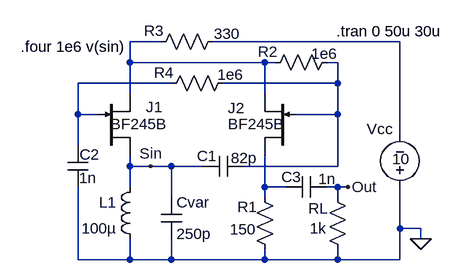
[diagram p0: schematic 2NjfOsc.asc]
2NjfOsc.asc, the LTspice schematic file:
Version 4
SHEET 1 880 680
WIRE -48 256 -48 208
WIRE -48 304 -48 256
WIRE -48 480 -48 368
WIRE -16 256 -48 256
WIRE 32 176 32 144
WIRE 32 224 32 176
WIRE 32 336 32 320
WIRE 32 368 32 336
WIRE 32 480 -48 480
WIRE 32 480 32 448
WIRE 64 336 32 336
WIRE 80 144 32 144
WIRE 96 208 -48 208
WIRE 96 336 64 336
WIRE 96 384 96 336
WIRE 96 480 32 480
WIRE 96 480 96 448
WIRE 144 336 96 336
WIRE 240 176 32 176
WIRE 240 224 240 176
WIRE 240 368 240 320
WIRE 240 384 240 368
WIRE 240 480 96 480
WIRE 240 480 240 464
WIRE 256 176 240 176
WIRE 272 368 240 368
WIRE 352 176 336 176
WIRE 352 208 176 208
WIRE 352 208 352 176
WIRE 352 256 288 256
WIRE 352 256 352 208
WIRE 352 336 208 336
WIRE 352 336 352 256
WIRE 352 368 336 368
WIRE 352 384 352 368
WIRE 352 480 240 480
WIRE 352 480 352 464
WIRE 368 368 352 368
WIRE 448 144 160 144
WIRE 448 288 448 144
WIRE 448 432 448 368
WIRE 448 480 352 480
WIRE 448 480 448 432
WIRE 480 432 448 432
WIRE 480 448 480 432
FLAG 480 448 0
FLAG 368 368 Out
FLAG 64 336 Sin
SYMBOL njf -16 320 M180
WINDOW 0 73 75 Left 0
WINDOW 3 18 49 Left 0
SYMATTR InstName J1
SYMATTR Value BF245B
SYMBOL njf 288 320 R180
WINDOW 0 79 74 Left 0
WINDOW 3 18 49 Left 0
SYMATTR InstName J2
SYMATTR Value BF245B
SYMBOL ind 48 352 M0
SYMATTR InstName L1
SYMATTR Value 100µ
SYMATTR SpiceLine Ipk=3.4 Rser=0.02 Rpar=0 Cpar=0 mfg="Coiltronics" pn="CTX10-4"
SYMBOL cap 80 384 R0
SYMATTR InstName Cvar
SYMATTR Value 250p
SYMBOL cap 208 320 R90
WINDOW 0 16 57 VBottom 0
WINDOW 3 -12 0 VTop 0
SYMATTR InstName C1
SYMATTR Value 82p
SYMBOL res 224 368 R0
WINDOW 0 -26 31 Left 0
WINDOW 3 -38 65 Left 0
SYMATTR InstName R1
SYMATTR Value 150
SYMBOL res 352 160 R90
WINDOW 0 15 107 VBottom 0
WINDOW 3 -13 20 VTop 0
SYMATTR InstName R2
SYMATTR Value 1e6
SYMBOL res 176 128 R90
WINDOW 0 15 107 VBottom 0
WINDOW 3 -12 -6 VTop 0
SYMATTR InstName R3
SYMATTR Value 330
SYMBOL voltage 448 384 R180
WINDOW 0 11 105 Left 0
WINDOW 3 -15 59 Left 0
SYMATTR InstName Vcc
SYMATTR Value 10
SYMBOL res 192 192 R90
WINDOW 0 15 107 VBottom 0
WINDOW 3 -13 5 VTop 0
SYMATTR InstName R4
SYMATTR Value 1e6
SYMBOL cap -64 304 R0
WINDOW 0 19 14 Left 0
WINDOW 3 18 50 Left 0
SYMATTR InstName C2
SYMATTR Value 1n
SYMBOL cap 336 352 R90
WINDOW 0 16 55 VBottom 0
WINDOW 3 -12 0 VTop 0
SYMATTR InstName C3
SYMATTR Value 1n
SYMBOL res 336 368 R0
WINDOW 0 -29 33 Left 0
WINDOW 3 -27 64 Left 0
SYMATTR InstName RL
SYMATTR Value 1k
TEXT 350 128 Left 0 !.tran 0 50u 30u
TEXT -136 152 Left 0 !.four 1e6 v(sin)

The netlist it stands for:
* 2NjfOsc.asc
J1 Sin N001 N002 BF245B
J2 N003 N004 N002 BF245B
L1 Sin 0 100µ Ipk=3.4 Rser=0.02 Rpar=0 Cpar=0 mfg="Coiltronics" pn="CTX10-4"
Cvar Sin 0 250p
C1 N004 Sin 82p
R1 N003 0 150
R2 N004 N002 1e6
R3 N005 N002 330
Vcc 0 N005 10
R4 N004 N001 1e6
C2 N001 0 1n
C3 Out N003 1n
RL Out 0 1k
.model NJF NJF
.model PJF PJF
.lib standard.jft
.tran 0 50u 30u
.four 1e6 v(sin)
.backanno
.end